# EAGLE design LiPolySonicScrewdriver (EAGLE 6.5.0)
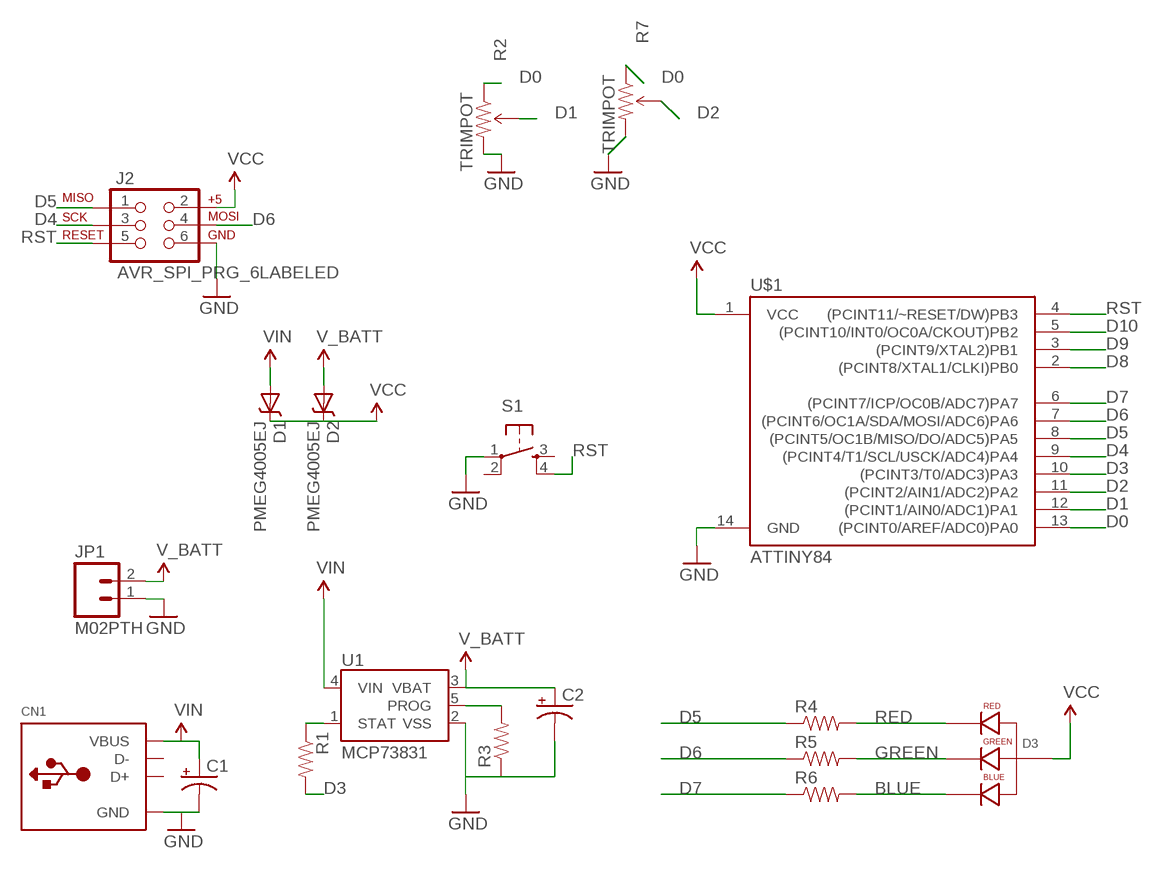
[diagram p0: schematic, sheet 1]

## Parts
C1  CAP_POL1206  [EIA3216]
C2  CAP_POL1206  [EIA3216]
CN1  USB_TYPEAPCB  [USBA_PCB]
D1  PMEG4005EJ  DIODE-SCHOTTKY-PMEG4005EJ  [SOD-323]
D2  PMEG4005EJ  DIODE-SCHOTTKY-PMEG4005EJ  [SOD-323]
D3  LED-RGB-CA-THRUEDGE  [LED-RGB-EDGE]
J2  AVR_SPI_PRG_6LABELED  [2X3-NS]
JP1  M02PTH  [1X02]
R1  RESISTOR0805-RES  [0805]
R2  TRIMPOT  [TRIMPOT-5MM-V2]
R3  RESISTOR0805-RES  [0805]
R4  RESISTOR1206  [1206]
R5  RESISTOR1206  [1206]
R6  RESISTOR1206  [1206]
R7  TRIMPOT  [TRIMPOT-5MM-V2]
S1  TAC_SWITCHSMD  [TACTILE-SWITCH-SMD]
U1  MCP73831  [SOT23-5]
U$1  ATTINY84  [SO14]

## Nets
BLUE: D3.4(BLUE_CATHODE) R6.2
D0: R2.A(CCW) R7.A(CCW) U$1.13((PCINT0/AREF/ADC0)PA0)
D1: R2.B(WIPER) U$1.12((PCINT1/AIN0/ADC1)PA1)
D2: R7.B(WIPER) U$1.11((PCINT2/AIN1/ADC2)PA2)
D3: R1.2 U$1.10((PCINT3/T0/ADC3)PA3)
D4: J2.3 U$1.9((PCINT4/T1/SCL/USCK/ADC4)PA4)
D5: J2.1 R4.1 U$1.8((PCINT5/OC1B/MISO/DO/ADC5)PA5)
D6: J2.4 R5.1 U$1.7((PCINT6/OC1A/SDA/MOSI/ADC6)PA6)
D7: R6.1 U$1.6((PCINT7/ICP/OC0B/ADC7)PA7)
D8: U$1.2((PCINT8/XTAL1/CLKI)PB0)
D9: U$1.3((PCINT9/XTAL2)PB1)
D10: U$1.5((PCINT10/INT0/OC0A/CKOUT)PB2)
GND: C1.C(-) C2.C(-) CN1.GND J2.6 JP1.1 R2.C(CW) R3.1 R7.C(CW) S1.1 U1.2(VSS) U$1.14(GND)
GREEN: D3.3(GREEN_CATHODE) R5.2
N$2: R3.2 U1.5(PROG)
RED: D3.1(RED_CATHODE) R4.2
RST: J2.5 S1.4 U$1.4((PCINT11/~RESET/DW)PB3)
STAT: R1.1 U1.1(STAT)
V_BATT: C2.A(+) D2.A JP1.2 U1.3(VBAT)
VCC: D1.C D2.C D3.2(ANODE) J2.2 U$1.1(VCC)
VIN: C1.A(+) CN1.VCC(VBUS) D1.A U1.4(VIN)
Unconnected: CN1.USB_NEG(D-) CN1.USB_PLUS(D+) S1.2 S1.3

## Library data of the parts
C1 C2 = barbary_enterprises:CAP_POL: Capacitor Polarized These are standard SMD and PTH capacitors. Normally 10uF, 47uF, and 100uF in electrolytic and tantalum varieties. Always verify the external diameter of the through hole cap, it varies with capacity, voltage, and manufacturer. The EIA devices should be standard.
CN1 = barbary_enterprises:USB_TYPEA: USB - Type A Connectors Male types stick out and are inserted into a PC or matching females parts (these are the connectors used on USB Memory Sticks, etc.). Female parts are generally used for USB Host and accept a male-type connector. SMT Male - 4UCON: 10017 PTH Female - Digikey: 609-1045-ND, 4UCon: 05241
D1 D2 = SparkFun-DiscreteSemi:DIODE-SCHOTTKY: Schottky diodes in SFE's production catalog BAT20J 1A 23V 0.62Vf RB751 120mA 40V 0.37Vf PMEG4005EJ 0.5A 40V 0.42Vf MBRA140 1A 40V 0.5Vf B340A 3A 40V SMA; PROD_ID: DIO-10955
D3 = barbary_enterprises:LED-RGB-CA-THRU: RGB Through-hole common anode SparkFun store front COM-10821 (diffuse) COM-10820 (clear)
J2 = barbary_enterprises:AVR_SPI_PRG_6: AVR ISP 6 Pin This is the reduced ISP connector for AVR programming. Common on Arduino. This footprint will take up less PCB space and can be used with a 10-pin to 6-pin adapter such as SKU: BOB-08508
JP1 = SparkFun-Connectors:M02: Standard 2-pin 0.1" header. Use with - straight break away headers ( PRT-00116) - right angle break away headers (PRT-00553) - swiss pins (PRT-00743) - machine pins (PRT-00117) - female headers (PRT-00115) Molex polarized connector foot print use with: PRT-08233 with associated crimp pins and housings. 2.54_SCREWTERM for use with PRT-10571. 3.5mm Screw Terminal footprints for PRT-08084 5mm Screw Terminal footprints for use with PRT-08433
R1 R3-R6 = barbary_enterprises:RESISTOR: Resistor Basic schematic elements and footprints for 0603, 1206, and PTH resistors.
R2 R7 = barbary_enterprises:TRIMPOT: Various small potentiometers for "set-and-forget" applications
S1 = barbary_enterprises:TAC_SWITCH: Momentary Switch Button commonly used for reset or general input. Spark Fun Electronics SKU : COM-00097 SMT- SWCH-08247
U1 = SparkFun-PowerIC:MCP73831: Miniature single cell, fully integrated Li-Ion, Li-polymer charge management controller http://ww1.microchip.com/downloads/en/DeviceDoc/21984a.pdf IC-09995; PROD_ID: IC-09995
U$1 = SparkFun-DigitalIC:ATTINY84: Atmel 14-pin 2/4/8kB flash uC

## Board
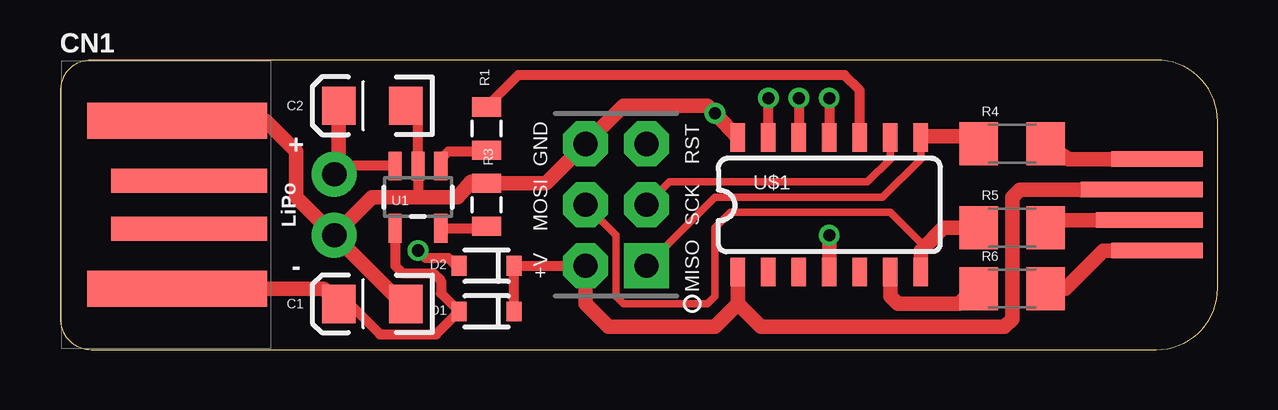
[diagram p1: board, top side]
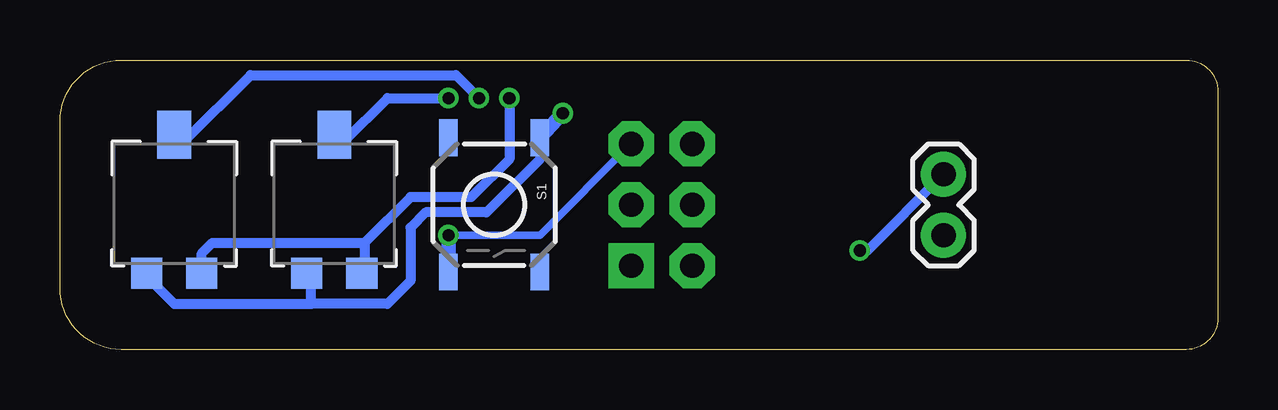
[diagram p2: board, bottom side, seen from below]

Size 48.26 x 12.06 mm. Coordinates in mm from the lower left corner, seen from the top.
Outline: 0,10.76 0,1.31 arc90 1.31,0 45.7,0 arc90 48.26,2.56 48.26,9.51 arc90 45.7,12.06 1.31,12.06 arc90 0,10.76
Copper layers (1*16): Top 0.0356mm / dielectric 1.5011mm / Bottom 0.0356mm
Design rules "LaenPCBOrder": minimum track width 6mil, minimum drill 13mil, track to track 6mil, track to pad 6mil, pad to pad 6mil, via to via 6mil, smd to smd 6mil, copper to edge 15mil, drill to drill 6mil, minimum pad ring 7mil, minimum via ring 7mil, stop-mask expansion 3mil, vias tented up to drill 0mil, thermal gap 10mil

### Footprints (pad centres in the part's own frame; a part is rotated, then mirrored left to right if it is on the bottom)
EIA3216 = smd 1.4 x 1.6: A 1.4,0; C -1.4,0
USBA_PCB = smd 7.5 x 1.5: GND -0.2,3.5; VCC -0.2,-3.5 | smd 6.5 x 1: USB_NEG 0.3,-1; USB_PLUS 0.3,1
SOD-323 = smd 0.63 x 0.83: A 1.15,0; C -1.15,0
LED-RGB-EDGE = smd 3.81 x 0.635: 1 -2.54,1.27; 4 -2.54,-2.54 | smd 5.08 x 0.635: 2 -3.175,0 | smd 4.445 x 0.635: 3 -2.857,-1.27
2X3-NS = drill 1.016 pad 1.88 square: 1 -2.54,-1.27 | drill 1.016 pad 1.88 octagon: 2 -2.54,1.27; 3 0,-1.27; 4 0,1.27; 5 2.54,-1.27; 6 2.54,1.27
1X02 = drill 1.016 pad 1.88: 1 0,0; 2 2.54,0
0805 = smd 0.8 x 1.2: 1 -0.9,0; 2 0.9,0
TRIMPOT-5MM-V2 = smd 1.3 x 1.3: A 1.15,-2.54; C -1.15,-2.54 | smd 1.402 x 2: B 0,3.239
1206 = smd 1.6 x 1.8: 1 -1.4,0; 2 1.4,0
TACTILE-SWITCH-SMD = smd 1.524 x 0.762: 1 -2.794,1.905; 2 2.794,1.905; 3 -2.794,-1.905; 4 2.794,-1.905
SOT23-5 = smd 0.55 x 1.2: 1 -0.95,-1.3; 2 0,-1.3; 3 0.95,-1.3; 4 0.95,1.3; 5 -0.95,1.3
SO14 = smd 0.6 x 1.2: 1 -3.81,-2.8; 2 -2.54,-2.8; 3 -1.27,-2.8; 4 0,-2.8; 5 1.27,-2.8; 6 2.54,-2.8; 7 3.81,-2.8; 8 3.81,2.8; 9 2.54,2.8; 10 1.27,2.8; 11 0,2.8; 12 -1.27,2.8; 13 -2.54,2.8; 14 -3.81,2.8

### Placement (x,y rotation side)
C1  13.02,1.91 180 top
C2  13.02,10.16 180 top
CN1  5.08,6.03 0 top
D1  17.78,1.59 180 top
D2  17.78,3.49 180 top
D3  48.26,6.67 0 top
J2  23.18,6.03 90 top
JP1  11.43,4.76 90 bottom
R1  17.78,9.21 90 top
R2  43.5,5.71 0 bottom
R3  17.78,6.03 270 top
R4  39.69,8.57 0 top
R5  39.69,5.08 0 top
R6  39.69,2.54 0 top
R7  36.83,5.71 0 bottom
S1  30.16,6.03 270 bottom
U1  14.92,6.35 180 top
U$1  32.07,6.03 0 top

### Tracks (layer width: path | path; a pad name or v marks a point on that pad's centre or on a via)
BLUE
  Top 0.61: D3.4 43.5,4.13 41.91,2.54 R6.2
D0  (via drill 0.51)
  Top 0.406: U$1.13 v29.53,10.48
  Bottom 0.406: v29.53,10.48 29.53,7.94 31.11,6.35 33.66,6.35 35.56,4.45 | 35.56,4.45 35.56,3.29 R7.A | R2.A 42.35,4.01 41.91,4.45 35.56,4.45
D1  (via drill 0.51)
  Top 0.406: v30.8,10.48 U$1.12
  Bottom 0.406: R2.B 43.08,8.68 40.32,11.43 31.75,11.43 v30.8,10.48
D2  (via drill 0.51)
  Top 0.406: v32.07,10.48 U$1.11
  Bottom 0.406: R7.B 36.41,8.68 34.61,10.48 v32.07,10.48
D3
  Top 0.406: U$1.10 33.34,10.79 32.7,11.43 19.1,11.43 R1.2
D4
  Top 0.305: U$1.9 34.61,7.94 33.66,6.99 25.4,6.99 J2.3
D5
  Top 0.305: U$1.8 35.88,7.94 34.29,6.35 27.3,6.35 J2.1
  Top 0.61: R4.1 37.97,8.89 35.94,8.89 U$1.8
D6
  Top 0.305: J2.4 23.18,4.76 23.18,2.22 23.5,1.91 26.99,1.91 27.3,2.22 27.3,5.08 27.94,5.71 34.61,5.71 35.88,4.45 35.88,4.13
  Top 0.61: U$1.7 35.88,4.13 36.83,5.08 R5.1
D7
  Top 0.61: U$1.6 34.61,2.22 34.92,1.91 37.47,1.91 38.1,2.54 38.1,2.49 R6.1
GND  (via drill 0.51)
  Top 0.406: C2.C 14.92,9.65 U1.2 14.92,6.35 | C1.C 14.29,1.91 | 17.14,6.99 17.73,6.99 R3.1
  Top 0.61: CN1.GND 8.56,9.53 9.84,8.26 9.84,6.35 JP1.1 | JP1.1 13.02,6.35 14.92,6.35 16.56,6.35 17.14,6.99 | 14.29,1.91 JP1.1 | R3.1 20.27,6.93 J2.6 23.5,10.16 26.99,10.16 v27.3,9.84 S1.1
  Bottom 0.406: S1.1 28.26,7.94 30.48,5.71 33.02,5.71 33.66,5.08 33.66,2.86 34.61,1.91 37.78,1.91 | 37.78,1.91 37.78,2.86 R7.C | R2.C 44.65,3.06 43.5,1.91 37.78,1.91
  Bottom 0.61: v27.3,9.84 S1.1
GREEN
  Top 0.61: D3.3 41.41,5.4 R5.2
N$2
  Top 0.406: U1.5 17.7,5.05 R3.2
RED
  Top 0.61: D3.1 42.04,7.94 R4.2
RST  (via drill 0.51)
  Top 0.61: U$1.4 v32.07,4.76
  Bottom 0.305: J2.5 28.26,4.76 v32.07,4.76
  Bottom 0.61: v32.07,4.76 S1.4
STAT
  Top 0.406: U1.1 15.87,7.93 16.19,8.26 17.73,8.26 R1.1
V_BATT  (via drill 0.51)
  Top 0.406: U1.3 11.78,7.65 JP1.2 | D2.A 16.51,3.49 16.19,3.81 15.24,3.81 v14.92,4.13
  Top 0.61: C2.A 11.62,7.49 JP1.2
  Bottom 0.406: v14.92,4.13 14.61,4.13 JP1.2
VCC
  Top 0.406: D1.C D2.C J2.2
  Top 0.61: D3.2 40.01,6.67 39.69,6.35 39.69,1.27 39.37,0.95 29.21,0.95 28.26,1.91 | 28.26,1.91 U$1.1 | J2.2 21.91,1.91 22.86,0.95 27.3,0.95 28.26,1.91
VIN
  Top 0.406: C1.A 12.06,1.91 13.34,0.64 15.68,0.64 D1.A 15.88,2.34 15.88,2.86 15.56,3.17 14.29,3.17 13.97,3.49 U1.4
  Top 0.61: CN1.VCC 10.99,2.53 C1.A

### Text on the board
tPlace: + | LiPo | -